# Altium schematic sheet Logic Board.SchDoc
size A3; SheetNumber: 1; SheetTotal: 2
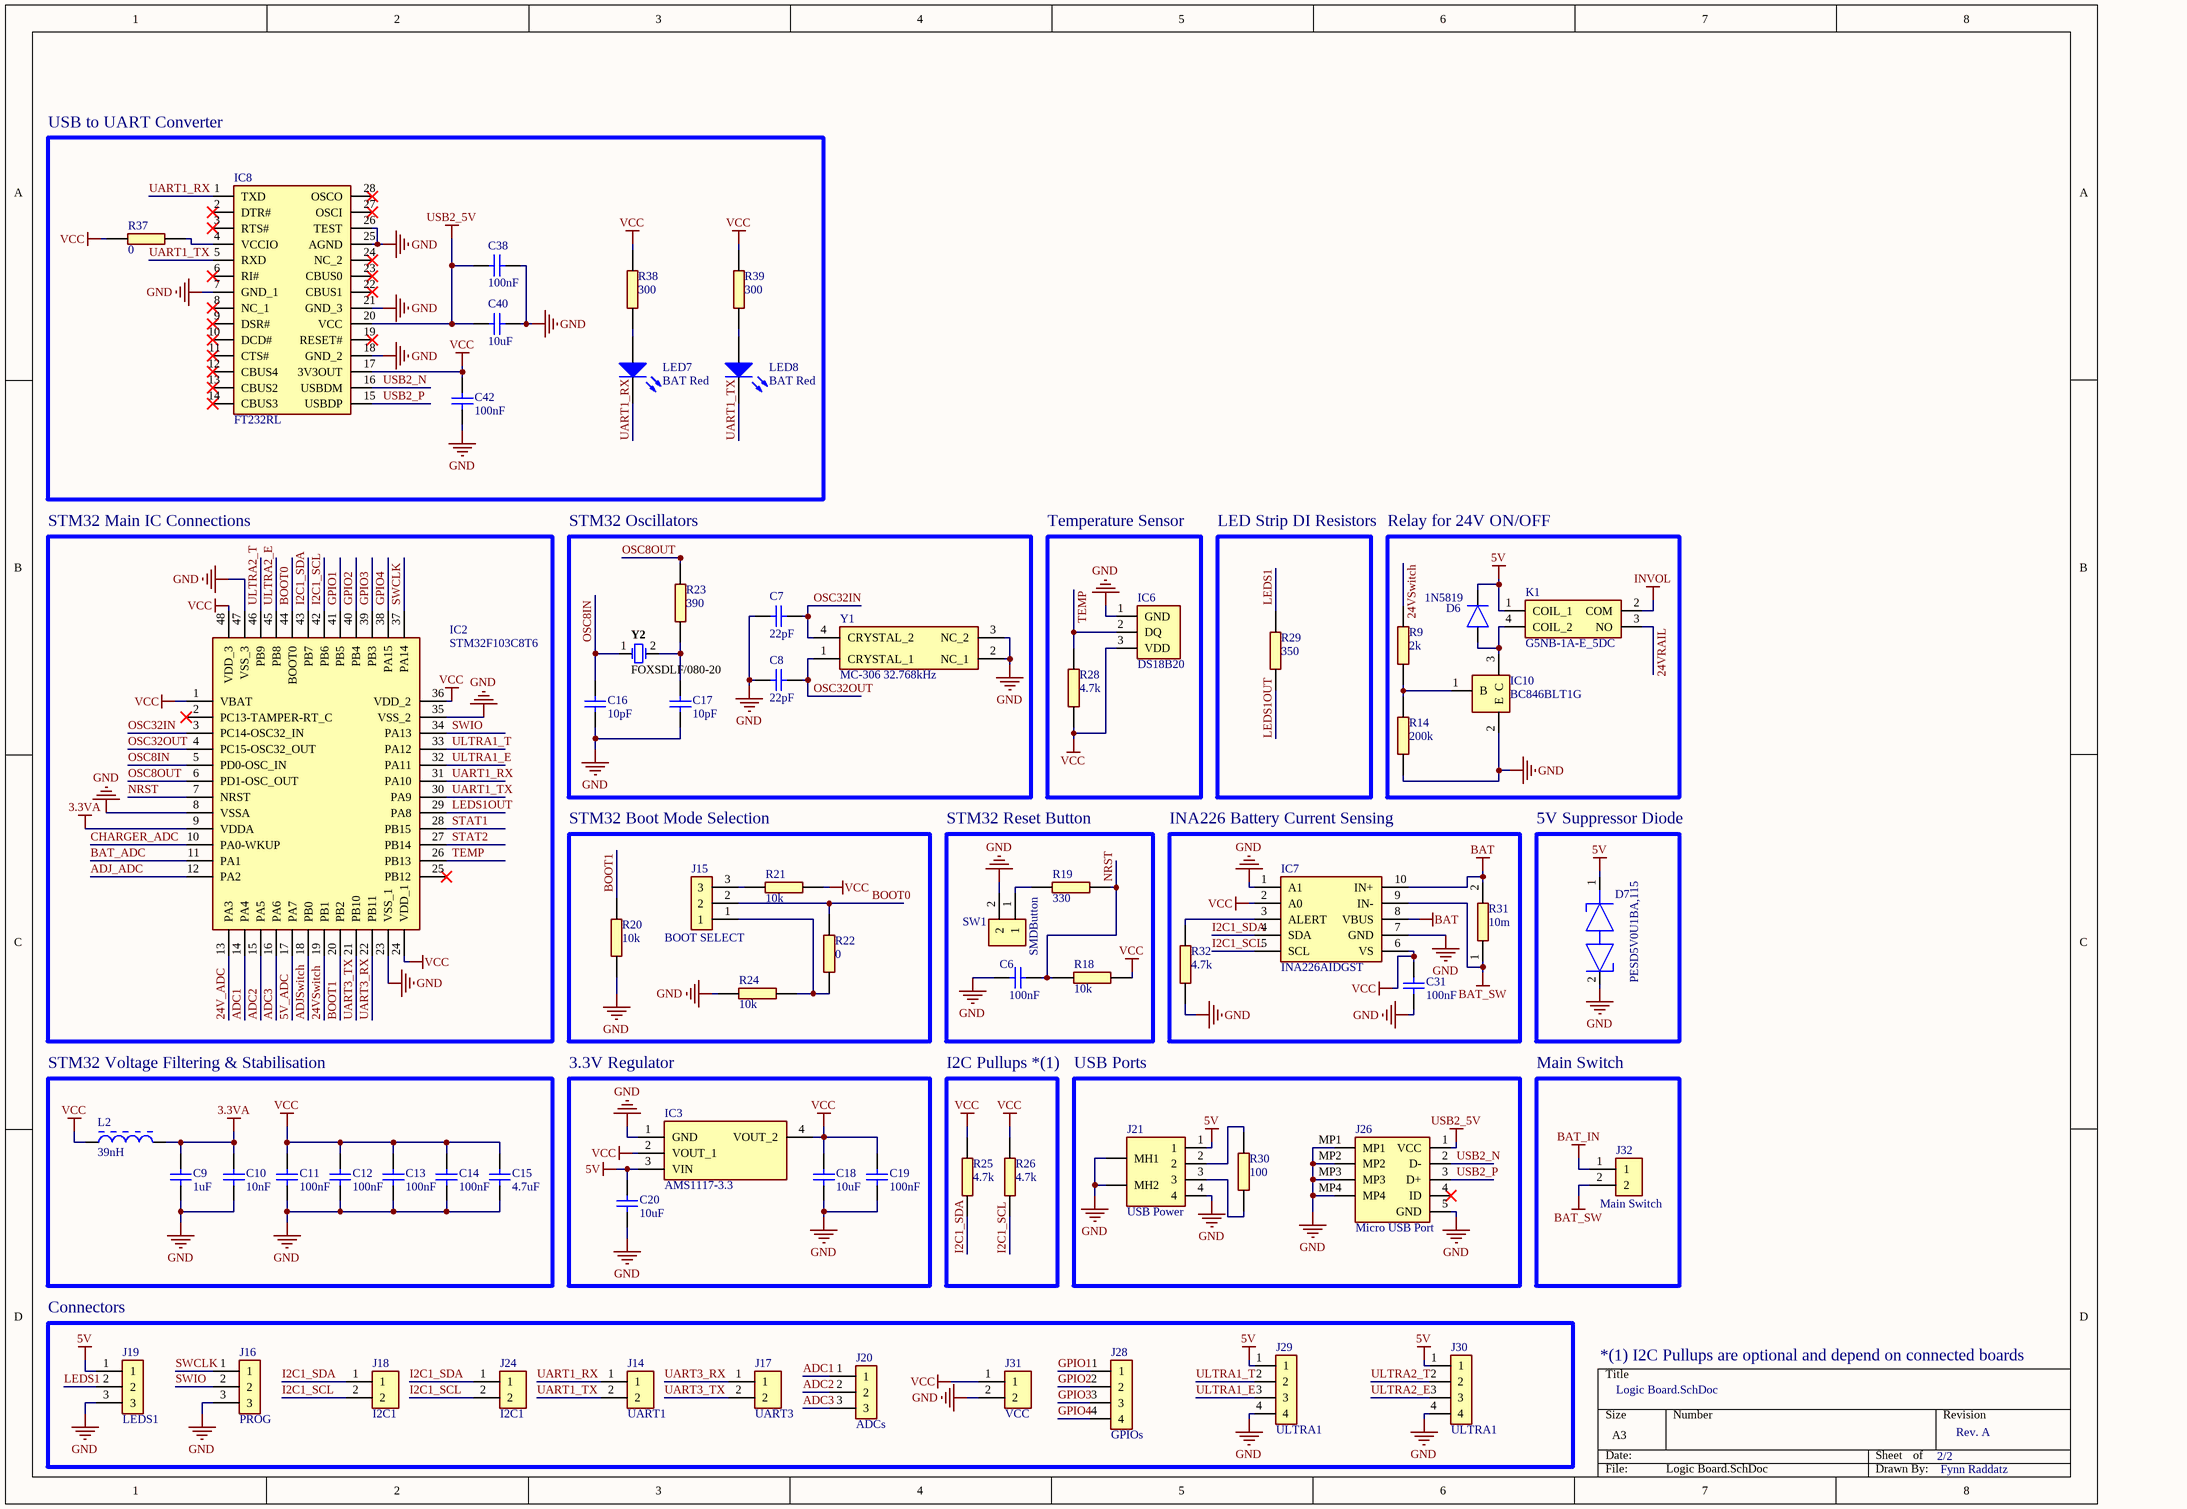
[diagram p0: Logic Board.SchDoc]

## Parts
C6  100nF  [CAPC2012 METRIC]
C7  22pF  [CAPC2012 METRIC]
C8  22pF  [CAPC2012 METRIC]
C9  1uF  [CAPC2012 METRIC]
C10  10nF  [CAPC2012 METRIC]
C11  100nF  [CAPC2012 METRIC]
C12  100nF  [CAPC2012 METRIC]
C13  100nF  [CAPC2012 METRIC]
C14  100nF  [CAPC2012 METRIC]
C15  4.7uF  [CAPC2012 METRIC]
C16  10pF  [CAPC2012 METRIC]
C17  10pF  [CAPC2012 METRIC]
C18  10uF  [CAPC2012 METRIC]
C19  100nF  [CAPC2012 METRIC]
C20  10uF  [CAPC2012 METRIC]
C31  100nF  [CAPC2012 METRIC]
C38  100nF  [CAPC2012 METRIC]
C40  10uF  [CAPC2012 METRIC]
C42  100nF  [CAPC2012 METRIC]
D6  1N5819  [SOD3716X145N]
D7  PESD5V0U1BA,115  [PESD1IVN27AX]
IC2  STM32F103C8T6  [QFP50P900X900X160-48N]
IC3  AMS1117-3.3  [SOT229P700X180-4N]
IC6  DS18B20  [DS18B20TR]
IC7  INA226AIDGST  [SOP50P490X110-10N]
IC8  FT232RL  [SOP65P778X200-28N]
IC10  BC846BLT1G  [SOT96P237X111-3N]
J14  UART1  [2 Pin Header BIG PADS]
J15  BOOT SELECT  [HDRV3W64P0X254_1X3_762X254X869P]
J16  PROG  [HDRV3W64P0X254_1X3_762X254X869P]
J17  UART3  [2 Pin Header BIG PADS]
J18  I2C1  [2 Pin Header BIG PADS]
J19  LEDS1  [HDRV3W64P0X254_1X3_762X254X869P]
J20  ADCs  [HDRV3W64P0X254_1X3_762X254X869P]
J21  USB Power  [875200010BLF]
J24  I2C1  [2 Pin Header BIG PADS]
J26  Micro USB Port  [101041100001LF]
J28  GPIOs  [HDRV4W95P0X254_1X4_1016X254X854P]
J29  ULTRA1  [HDRV4W95P0X254_1X4_1016X254X854P]
J30  ULTRA1  [HDRV4W95P0X254_1X4_1016X254X854P]
J31  VCC  [2 Pin Header BIG PADS]
J32  Main Switch  [2 Pin Header BIG PADS]
K1  G5NB-1A-E_5DC  [G5NB1A4DC5]
L2  39nH  [LIRD-LI0805H151R-10-2_V]
LED7  BAT Red  [1206_A]
LED8  BAT Red  [1206_A]
R9  2k  [RESC2012X65N]
R14  200k  [RESC2012X65N]
R18  10k  [RESC2012X65N]
R19  330  [RESC2012X65N]
R20  10k  [RESC2012X65N]
R21  10k  [RESC2012X65N]
R22  0  [RESC2012X65N]
R23  390  [RESC2012X65N]
R24  10k  [RESC2012X65N]
R25  4.7k  [RESC2012X65N]
R26  4.7k  [RESC2012X65N]
R28  4.7k  [RESC2012X65N]
R29  350  [RESC2012X65N]
R30  100  [RESC2012X65N]
R31  10m  [RESC5025X88N]
R32  4.7k  [RESC2012X65N]
R37  0  [RESC2012X65N]
R38  300  [RESC2012X65N]
R39  300  [RESC2012X65N]
SW1  SMDButton  [SMD-Button-3*6mm]
Y1  MC-306 32.768kHz  [MC306327680KA3ROHS]
Y2  FOXSDLF/080-20  [FOX-HC49SDLF_V]

## Blocks framed on the sheet
USB to UART Converter: C38 C40 C42 IC8 LED7 LED8 R37-R39
STM32 Main IC Connections: IC2
STM32 Oscillators: C7 C8 C16 C17 R23 Y1 Y2
Temperature Sensor: IC6 R28
LED Strip DI Resistors: R29
Relay for 24V ON/OFF: D6 IC10 K1 R9 R14
STM32 Boot Mode Selection: J15 R20-R22 R24
STM32 Reset Button: C6 R18 R19 SW1
INA226 Battery Current Sensing: C31 IC7 R31 R32
5V Suppressor Diode: D7
STM32 Voltage Filtering & Stabilisation: C9-C15 L2
3.3V Regulator: C18-C20 IC3
I2C Pullups *(1): R25 R26
USB Ports: J21 J26 R30
Main Switch: J32
Connectors: J14 J16-J20 J24 J28-J31

## Nets
3.3VA: C9.2 C10.2 IC2.9(VDDA) L2.2
5V: C20.2 D6.1(K) D7.1(K1) IC3.3(VIN) J19.1 J21.1 J29.1 J30.1 K1.1(COIL_1)
BAT: IC7.8(VBUS) IC7.10(IN+) R31.2
BAT_IN: J32.1
BAT_SW: IC7.9(IN-) J32.2 R31.1
GND: C6.2 C7.2 C8.2 C9.1 C10.1 C11.1 C12.1 C13.1 C14.1 C15.1 C16.1 C17.1 C18.1 C19.1 C20.1 C31.1 C38.2 C40.2 C42.2 D7.2(K2) IC2.8(VSSA) IC2.23(VSS_1) IC2.35(VSS_2) IC2.47(VSS_3) IC3.1(GND) IC6.1(GND) IC7.1(A1) IC7.7(GND) IC8.7(GND_1) IC8.18(GND_2) IC8.21(GND_3) IC8.25(AGND) IC8.26(TEST) IC10.2(E) J16.3 J19.3 J21.4 J21.MH1 J21.MH2 J26.5(GND) J26.MP1 J26.MP2 J26.MP3 J26.MP4 J29.4 J30.4 J31.2 R14.1 R20.1 R24.1 R32.2 SW1.2 Y1.2(NC_1) Y1.3(NC_2)
INVOL: K1.2(COM)
USB2_5V: C38.1 C40.1 IC8.20(VCC) J26.1(VCC)
VCC: C11.2 C12.2 C13.2 C14.2 C15.2 C18.2 C19.2 C31.2 C42.1 IC2.1(VBAT) IC2.24(VDD_1) IC2.36(VDD_2) IC2.48(VDD_3) IC3.2(VOUT_1) IC3.4(VOUT_2) IC6.3(VDD) IC7.2(A0) IC7.6(VS) IC8.17(3V3OUT) J31.1 L2.1 R18.2 R21.1 R25.1 R26.1 R28.1 R37.2 R38.2 R39.2
5V_ADC: IC2.17(PA7)
24V_ADC: IC2.13(PA3)
24VRAIL: K1.3(NO)
24VSwitch: IC2.19(PB1) R9.2
ADC1: IC2.14(PA4) J20.1
ADC2: IC2.15(PA5) J20.2
ADC3: IC2.16(PA6) J20.3
ADJ_ADC: IC2.12(PA2)
ADJSwitch: IC2.18(PB0)
BAT_ADC: IC2.11(PA1)
BOOT0: IC2.44(BOOT0) J15.2 R22.1
BOOT1: IC2.20(PB2) R20.2
CHARGER_ADC: IC2.10(PA0-WKUP)
GPIO1: IC2.41(PB5) J28.1
GPIO2: IC2.40(PB4) J28.2
GPIO3: IC2.39(PB3) J28.3
GPIO4: IC2.38(PA15) J28.4
I2C1_SCL: IC2.42(PB6) IC7.5(SCL) J18.2 J24.2 R26.2
I2C1_SDA: IC2.43(PB7) IC7.4(SDA) J18.1 J24.1 R25.2
LEDS1: J19.2 R29.2
LEDS1OUT: IC2.29(PA8) R29.1
NRST: C6.1 IC2.7(NRST) R18.1 R19.1
OSC8IN: C16.2 IC2.5(PD0-OSC_IN) Y2.1
OSC8OUT: IC2.6(PD1-OSC_OUT) R23.2
OSC32IN: C7.1 IC2.3(PC14-OSC32_IN) Y1.4(CRYSTAL_2)
OSC32OUT: C8.1 IC2.4(PC15-OSC32_OUT) Y1.1(CRYSTAL_1)
STAT1: IC2.28(PB15)
STAT2: IC2.27(PB14)
SWCLK: IC2.37(PA14) J16.1
SWIO: IC2.34(PA13) J16.2
TEMP: IC2.26(PB13) IC6.2(DQ) R28.2
UART1_RX: IC2.31(PA10) IC8.1(TXD) J14.1 LED7.1(K)
UART1_TX: IC2.30(PA9) IC8.5(RXD) J14.2 LED8.1(K)
UART3_RX: IC2.22(PB11) J17.1
UART3_TX: IC2.21(PB10) J17.2
ULTRA1_E: IC2.32(PA11) J29.3
ULTRA1_T: IC2.33(PA12) J29.2
ULTRA2_E: IC2.45(PB8) J30.3
ULTRA2_T: IC2.46(PB9) J30.2
USB2_N: IC8.16(USBDM) J26.2(D-)
USB2_P: IC8.15(USBDP) J26.3(D+)
NetC17_2: C17.2 R23.1 Y2.2
NetD6_2: D6.2(A) IC10.3(C) K1.4(COIL_2)
NetIC7_3: IC7.3(ALERT) R32.1
NetIC8_4: IC8.4(VCCIO) R37.1
NetIC10_1: IC10.1(B) R9.1 R14.2
NetJ15_1: J15.1 R22.2 R24.2
NetJ15_3: J15.3 R21.2
NetJ21_2: J21.2 R30.1
NetJ21_3: J21.3 R30.2
NetLED7_2: LED7.2(A) R38.1
NetLED8_2: LED8.2(A) R39.1
NetR19_2: R19.2 SW1.1

Not connected (* = marked no-connect by the designer): IC2 2(PC13-TAMPER-RT_C)* 25(PB12)*; IC8 2(DTR#)* 3(RTS#)* 6(RI#)* 8(NC_1)* 9(DSR#)* 10(DCD#)* 11(CTS#)* 12(CBUS4)* 13(CBUS2)* 14(CBUS3)* 19(RESET#)* 22(CBUS1)* 23(CBUS0)* 24(NC_2)* 27(OSCI)* 28(OSCO)*; J26 4(ID)*

## Notes on the sheet
- *(1) I2C Pullups are optional and depend on connected boards
- 2/2
- Rev. A
- Fynn Raddatz

## Library data of the parts
C6-C20 C31 C38 C40 C42 = CL21B104KACNNNC: Capacitor; Manufacturer_Name: Samsung Electro-Mechanics; Datasheet Link: http://www.samsungsem.com/kr/support/product-search/mlcc/__icsFiles/afieldfile/2016/08/18/S_CL21B104KACNNNC.pdf; Height: 0.95mm; Manufacturer_Part_Number: CL21B104KACNNNC; Mouser Part Number: N/A; Mouser Price/Stock: https://www.mouser.co.uk/ProductDetail/Samsung-Electro-Mechanics/CL21B104KACNNNC?qs=yOVawPpwOwnhB47kNbieFw%3D%3D; Arrow Part Number: CL21B104KACNNNC; Arrow Price/Stock: https://www.arrow.com/en/products/cl21b104kacnnnc/samsung-electro-mechanics
D6 = 1N5819HW-7-F: Diode; Manufacturer_Name: Diodes Inc.; Datasheet Link: http://www.diodes.com/_files/datasheets/ds30217.pdf; Height: 1.45mm; Manufacturer_Part_Number: 1N5819HW-7-F; Mouser Part Number: 621-1N5819HW-F; Mouser Price/Stock: https://www.mouser.co.uk/ProductDetail/Diodes-Incorporated/1N5819HW-7-F/?qs=NQ47qNm99eDyWTEd07miYA%3D%3D; Arrow Part Number: 1N5819HW-7-F; Arrow Price/Stock: https://www.arrow.com/en/products/1n5819hw-7-f/diodes-incorporated
D7 = PESD5V0U1BA,115: Diode ESD (Bi-directional); Manufacturer_Name: Nexperia; Datasheet Link: https://assets.nexperia.com/documents/data-sheet/PESD5V0U1BA.pdf; Height: 1.1mm; Manufacturer_Part_Number: PESD5V0U1BA,115; Mouser Part Number: 771-PESD5V0U1BA115; Mouser Price/Stock: https://www.mouser.com/Search/Refine.aspx?Keyword=771-PESD5V0U1BA115; Arrow Part Number: PESD5V0U1BA,115; Arrow Price/Stock: https://www.arrow.com/en/products/pesd5v0u1ba115/nexperia
IC2 = STM32F103C8T6TR: Integrated Circuit; Manufacturer_Name: STMicroelectronics; Datasheet Link: http://media.digikey.com/pdf/Data%20Sheets/ST%20Microelectronics%20PDFS/STM32F103x8,B.pdf; Height: 1.6mm; Manufacturer_Part_Number: STM32F103C8T6TR; Mouser Part Number: 511-STM32F103C8T6TR; Mouser Price/Stock: https://www.mouser.co.uk/ProductDetail/STMicroelectronics/STM32F103C8T6TR/?qs=5HwTSiuA5HDxFj62n06yag%3D%3D; Arrow Part Number: STM32F103C8T6TR; Arrow Price/Stock: https://www.arrow.com/en/products/stm32f103c8t6tr/stmicroelectronics
IC3 = AMS1117-3.3: Integrated Circuit; Manufacturer_Name: Advanced Monolithic Systems; Datasheet Link: http://www.advanced-monolithic.com/pdf/ds1117.pdf; Height: 1.8mm; Manufacturer_Part_Number: AMS1117-3.3
IC6 = DS18B20+T&R: Integrated Circuit; Manufacturer_Name: Maxim Integrated; Datasheet Link: https://componentsearchengine.com/Datasheets/1/DS18B20+T&R.pdf; Height: 10.41mm; Manufacturer_Part_Number: DS18B20+T&R; Mouser Part Number: 700-DS18B20T&R; Mouser Price/Stock: https://www.mouser.co.uk/ProductDetail/Maxim-Integrated/DS18B20%2bTR/?qs=7H2Jq%252ByxpJKpIDCbiq4lfg%3D%3D
IC7 = INA226AIDGST: Integrated Circuit; Manufacturer_Name: Texas Instruments; Datasheet Link: http://www.ti.com/lit/gpn/ina226; Height: 1.1mm; Manufacturer_Part_Number: INA226AIDGST; Mouser Part Number: 595-INA226AIDGST; Mouser Price/Stock: https://www.mouser.co.uk/ProductDetail/Texas-Instruments/INA226AIDGST?qs=tQG3bEuiOZB3Ay2BJOjnEQ%3D%3D; Arrow Part Number: INA226AIDGST; Arrow Price/Stock: https://www.arrow.com/en/products/ina226aidgst/texas-instruments
IC8 = FT232RL: Integrated Circuit; Manufacturer_Name: FTDI Chip; Datasheet Link: http://www.ftdichip.com/Support/Documents/DataSheets/ICs/DS_FT232R.pdf; Height: 2mm; Manufacturer_Part_Number: FT232RL; Arrow Part Number: FT232RL; Arrow Price/Stock: https://www.arrow.com/en/products/ft232rl/ftdi-chip
IC10 = BC846BLT1G: Integrated Circuit; Manufacturer_Name: ON Semiconductor; Datasheet Link: http://www.onsemi.com/pub/Collateral/BC846ALT1-D.PDF; Height: 1.11mm; Manufacturer_Part_Number: BC846BLT1G; Mouser Part Number: 863-BC846BLT1G; Mouser Price/Stock: https://www.mouser.co.uk/ProductDetail/onsemi/BC846BLT1G?qs=vNc2DXHODiJuwwGLruzsRg%3D%3D; Arrow Part Number: BC846BLT1G; Arrow Price/Stock: https://www.arrow.com/en/products/bc846blt1g/on-semiconductor
J14 J17 J18 J24 J31 J32 = 2 Pin Header Big Pad: Connector; Manufacturer_Name: Wurth Elektronik; Manufacturer_Part_Number: 61300211121; Datasheet Link: https://componentsearchengine.com/Datasheets/2/61300211121.pdf; Height: 8.54mm; Mouser Part Number: 710-61300211121; Mouser Price/Stock: https://www.mouser.co.uk/ProductDetail/Wurth-Elektronik/61300211121/?qs=t4813l51qx%252B1A5GYDQxPlw%3D%3D
J15 J16 J19 J20 = 61300311121: Connector; Manufacturer_Name: Wurth Elektronik; Datasheet Link: http://katalog.we-online.de/em/datasheet/6130xx11121.pdf; Height: 8.69mm; Manufacturer_Part_Number: 61300311121; Mouser Part Number: 710-61300311121; Mouser Price/Stock: https://www.mouser.co.uk/ProductDetail/Wurth-Elektronik/61300311121/?qs=PhR8RmCirEYxRWFJzNKsUw%3D%3D
J21 = 87520-0010BLF: Connector; Manufacturer_Name: Amphenol; Datasheet Link: https://componentsearchengine.com/Datasheets/1/87520-0010BLF.pdf; Height: 7.8mm; Manufacturer_Part_Number: 87520-0010BLF; Mouser Part Number: 649-87520-0010BLF; Mouser Price/Stock: https://www.mouser.co.uk/ProductDetail/Amphenol-FCI/87520-0010BLF?qs=x6EjVpvqMVP%2F2to87x7cdQ%3D%3D; Arrow Part Number: 87520-0010BLF; Arrow Price/Stock: https://www.arrow.com/en/products/87520-0010blf/amphenol-fci
J26 = Micro USB Port: Connector; Manufacturer_Name: Amphenol; Manufacturer_Part_Number: 10104110-0001LF; Datasheet Link: https://componentsearchengine.com/Datasheets/1/10104110-0001LF.pdf; Height: 2.98mm; Mouser Part Number: 649-10104110-0001LF; Mouser Price/Stock: https://www.mouser.co.uk/ProductDetail/Amphenol-FCI/10104110-0001LF?qs=3wMSRtz0%252BRoQF1VV4tle7w%3D%3D; Arrow Part Number: 10104110-0001LF; Arrow Price/Stock: https://www.arrow.com/en/products/10104110-0001lf/amphenol-fci?region=nac
J28-J30 = 61300411121: Connector; Manufacturer_Name: Wurth Elektronik; Datasheet Link: http://katalog.we-online.de/em/datasheet/6130xx11121.pdf; Height: 8.54mm; Manufacturer_Part_Number: 61300411121; Mouser Part Number: 710-61300411121; Mouser Price/Stock: https://www.mouser.co.uk/ProductDetail/Wurth-Elektronik/61300411121?qs=PhR8RmCirEYQcLLqXD8rAA%3D%3D
K1 = G5NB-1A-E_5DC: Relay or Contactor; Manufacturer_Name: Omron Electronics; Manufacturer_Part_Number: G5NB-1A-E 5DC; Datasheet Link: https://omronfs.omron.com/en_US/ecb/products/pdf/en-g5nb.pdf; Height: 15mm
L2 = CMP-2000-06404-1: Chip Bead, 100 MHz, 5 A, -40 to 125 degC, 2-Pin SMD (0805), RoHS, Tape and Reel; Manufacturer: Laird; DC Resistance (DCR) (Max): 10mOhm; Current Rating (Max): 5A; Kits: 240-2227-ND-KITEMIFERRITEBEADCHIPSMD; Filter Type: Power,SignalLine; Impedance @ Frequency: 80Ohm@100MHz; Online Catalog: HISeries; Other Names: 240-2395-1; Catalog Drawings: (HI,HZ,LI,MI)0805Series_1.10mmMax.Height; Package Version: Rev. D, 08/2013; Number of Lines: 1; Package / Case: 0805(2012Metric); Package URL: http://cdn.lairdtech.com/home/brandworld/files/LI0805H151R-10.pdf; Standard Package: 1; Manufacturer URL: https://www.lairdtech.com/; Ratings: -; Height (Max): 0.043"(1.10mm); Package Description: 2-Pin Surface Mount Device, Body 2 x 1.25 mm; Category: Filters; Series: HI; Packaging: CutTape(CT); Package Reference: LI0805H15R-10-2; Operating Temperature: -40°C~125°C; Datasheet URL: http://cdn.lairdtech.com/home/brandworld/files/HI0805R800R-10.pdf; Size / Dimension: 0.079"Lx0.049"W(2.00mmx1.25mm); Datasheet Version: Rev. E, 08/2013; Mounting Type: SurfaceMount; Family: FerriteBeadsandChips; Mounting Technology: SurfaceMount
LED7 LED8 = CMP-1426-00014-1: SMD mono-color Chip LED, WL-SMCW, Green; Manufacturer: Wuerth Elektronik; PartNumber: 150120GS75000; PackageReference: 1206_A; ComponentLink1Description: Manufacturer URL; ComponentLink2URL: http://katalog.we-online.com/led/datasheet/150120GS75000.pdf; ComponentLink2Description: Datasheet; Color: Green; ComponentLink1URL: http://www.we-online.com
R9 R14 R18-R26 R28-R30 R32 R37-R39 = RMCF0805ZT0R00: Resistor; Manufacturer_Name: Stackpole Electronics Inc.; Datasheet Link: https://www.seielect.com/Catalog/SEI-RMCF_RMCP.pdf; Height: 0.65mm; Manufacturer_Part_Number: RMCF0805ZT0R00; Arrow Part Number: RMCF0805ZT0R00; Arrow Price/Stock: https://www.arrow.com/en/products/rmcf0805zt0r00/stackpole-electronics
R31 = WSL2010R0100FEA18: Resistor; Manufacturer_Name: Vishay; Datasheet Link: http://componentsearchengine.com/Datasheets/1/WSL2010R0100FEA18.pdf; Manufacturer_Part_Number: WSL2010R0100FEA18; Mouser Part Number: 71-WSL2010R0100FEA18; Mouser Price/Stock: https://www.mouser.co.uk/ProductDetail/Vishay-Dale/WSL2010R0100FEA18?qs=IZrxGxQQvkOPmTjw6svrGg%3D%3D; Arrow Part Number: WSL2010R0100FEA18; Arrow Price/Stock: https://www.arrow.com/en/products/wsl2010r0100fea18/vishay?region=nac
SW1 = SMDButton-3*6mm
Y1 = MC-306_32.7680K-A3_ROHS: Crystal or Oscillator; Manufacturer_Name: Epson Timing; Manufacturer_Part_Number: MC-306 32.7680K-A3:ROHS; Datasheet Link: https://componentsearchengine.com/Datasheets/1/MC-306 32.7680K-A3_ROHS.pdf; Height: 2.54mm; Mouser Part Number: 732-MC306-32.7KA3R; Mouser Price/Stock: https://www.mouser.co.uk/ProductDetail/Epson-Timing/MC-306-327680K-A3ROHS/?qs=CU9taR8hkvbxBMNmXnQ1pw%3D%3D
Y2 = CMP-2100-03639-1: Resistance Weld Crystal, 8 MHz, +/- 30 ppm, -20 to 70 degC, 2-Pin SMD, RoHS, Tape and Reel; Manufacturer: FOX Electronics; Series Resistance: 80Ohm; Frequency: 8MHz; Load Capacitance: 20pF; Tolerance: 50ppm; Frequency Tolerance: 30ppm; Datasheet URL: http://www.foxonline.com/pdfs/hc49sdlf.pdf; Package Reference: HC49SDLF; Height: 4.5mm; Mount: SurfaceMount; Packaging: TapeandReel; Length: 11.7mm; Termination: SMD/SMT; Number of Pins: 2; Depth: 5mm; Min Operating Temperature: -20degC; Package Quantity: 1000; RoHSCompliant: True; Lead Free: LeadFree; Width: 5mm; Case/Package: SMD/SMT; Manufacturer URL: http://www.foxonline.com/; Max Operating Temperature: 70degC; REACH SVHC: NoSVHC; Datasheet Version: 42064.0; Package Description: 2-Pin Surface Mount Device, Body 5 x 11.7 mm; Frequency Stability: 50ppm; ESR (Equivalent Series Resistance): 80Ohm; Radiation Hardening: No